# Altium schematic sheet power.SchDoc
size A3; Organization: 合肥弗雷电子; Address1: 玉兰达到14号D栋3楼; Address2: 肥西县桃花镇; Address3: 合肥市; Address4: 安徽省
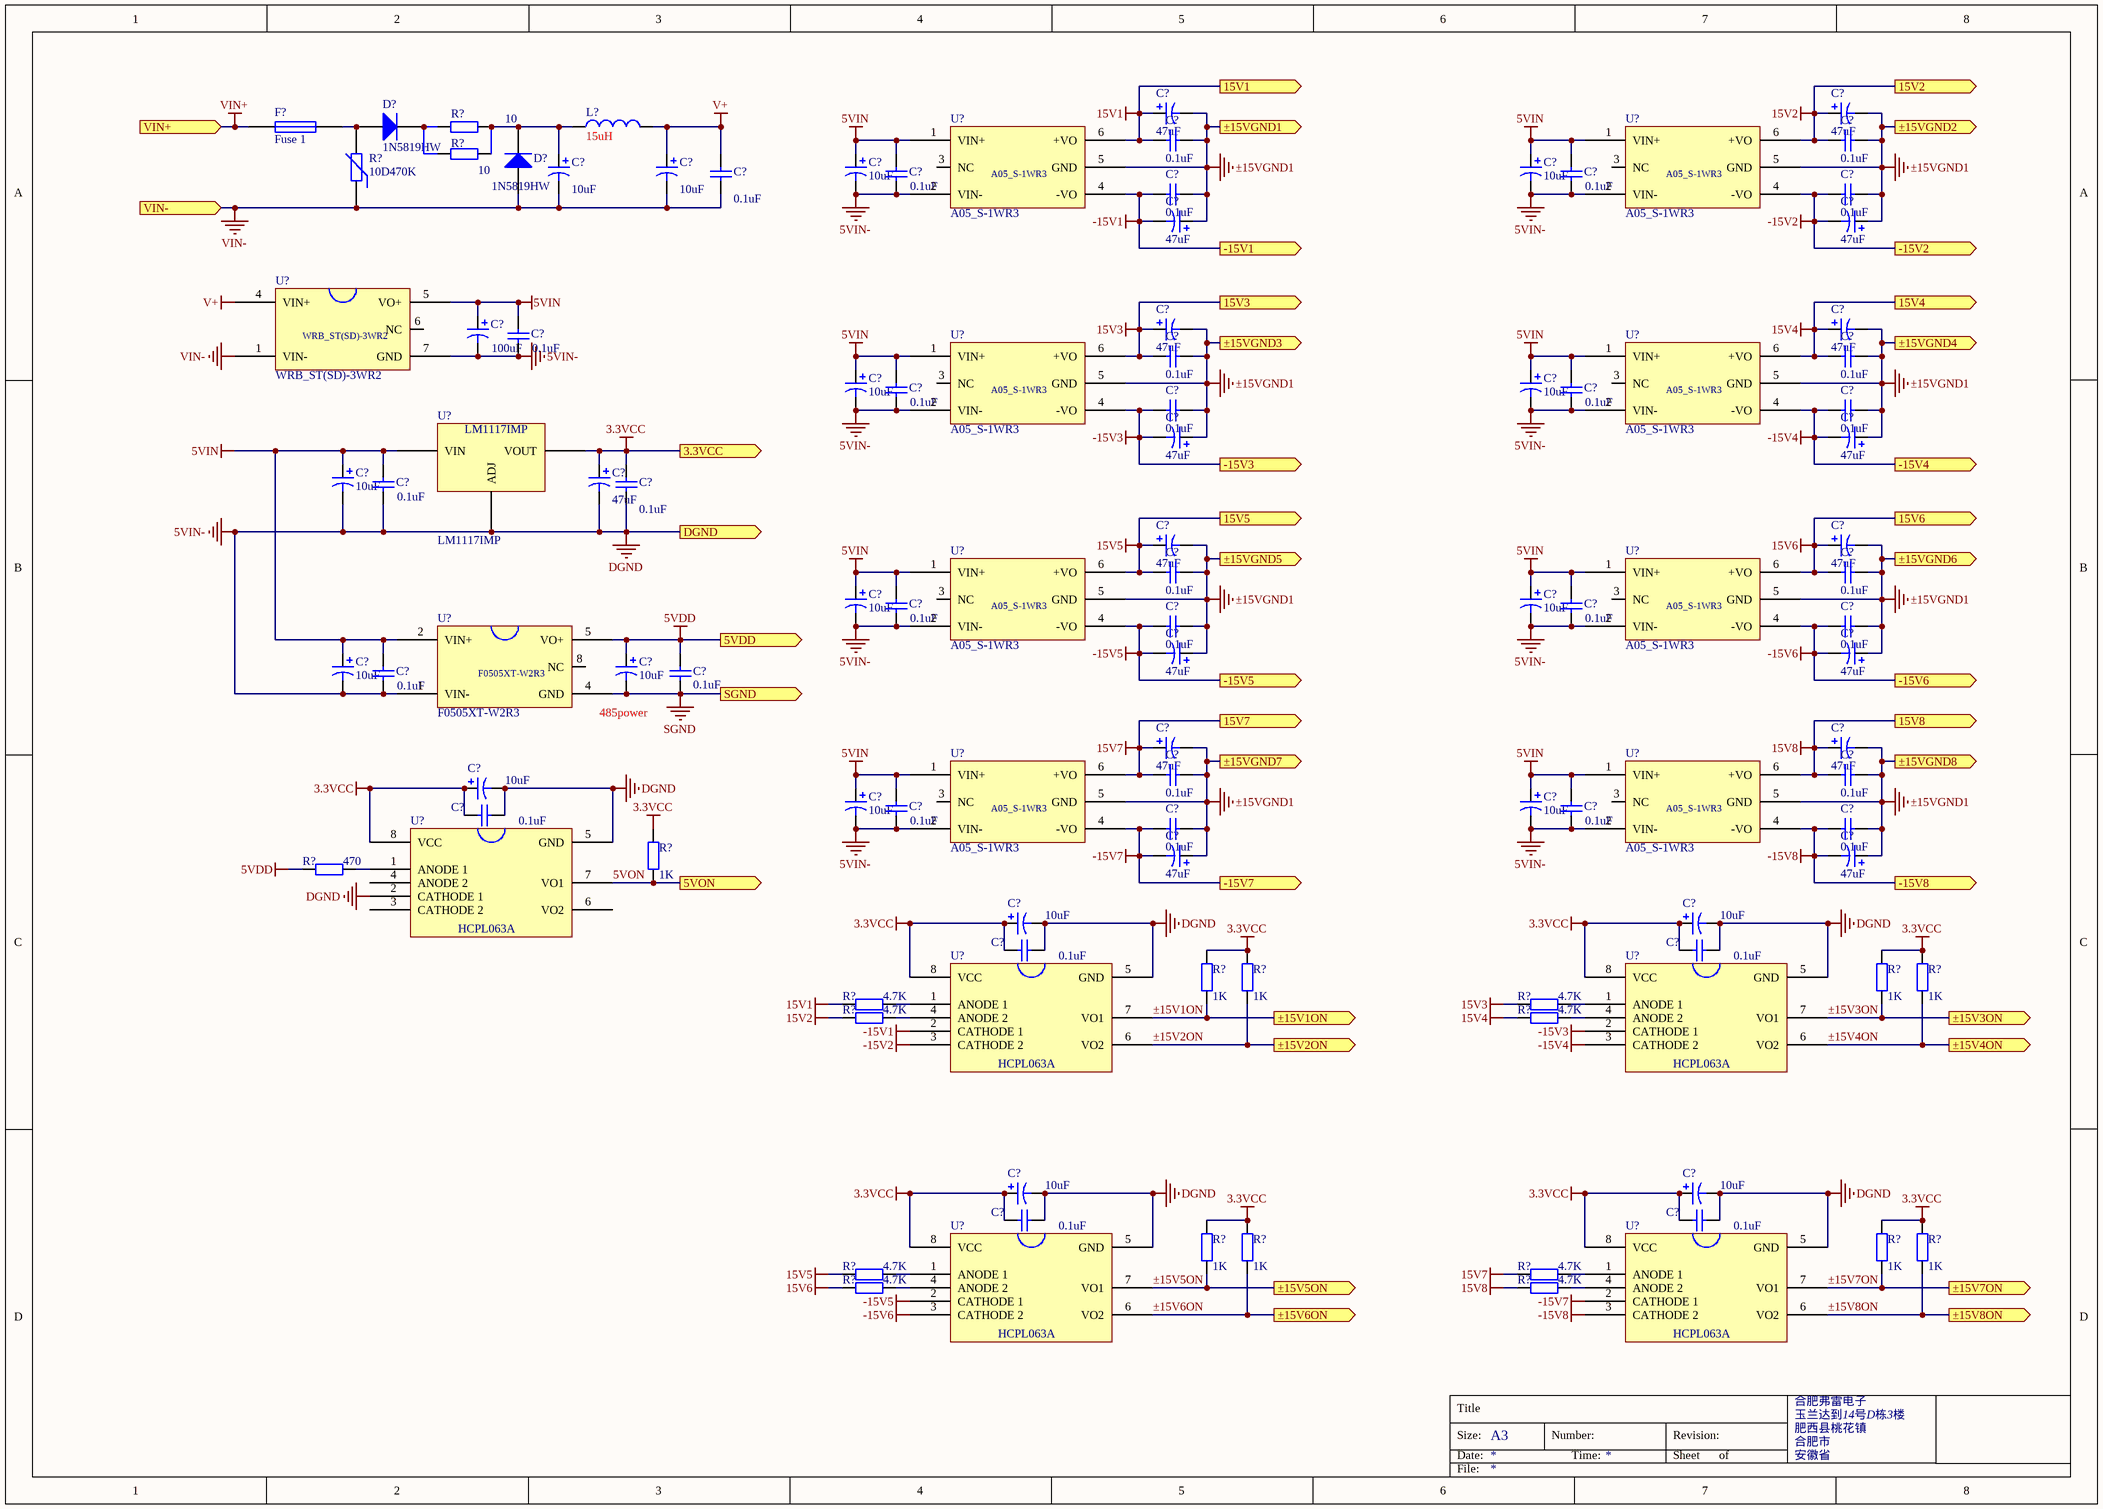
[diagram p0: power.SchDoc]

## Parts
(Parts that share a designator on the sheet are numbered #1, #2 ... from top to bottom, then left to right.)
C?#1  value 47uF  [CB]  (hidden comment: T494B476K025ATAUTO)
C?#2  value 47uF  [CB]  (hidden comment: T494B476K025ATAUTO)
C?#3  value 0.1uF  [0805c]  (hidden comment: CC0805MRX7R9BB104)
C?#4  value 0.1uF  [0805c]  (hidden comment: CC0805MRX7R9BB104)
C?#5  value 10uF  [Φ6.3×11.5]  (hidden comment: ECR1HQG100M-063007)
C?#6  value 10uF  [Φ6.3×11.5]  (hidden comment: ECR1HQG100M-063007)
C?#7  value 0.1uF  [0805c]  (hidden comment: CC0805MRX7R9BB104)
C?#8  value 10uF  [CB]  (hidden comment: T494B106M006AHAUTO)
C?#9  value 10uF  [CB]  (hidden comment: T494B106M006AHAUTO)
C?#10  value 0.1uF  [0805c]  (hidden comment: CC0805MRX7R9BB104)
C?#11  value 0.1uF  [0805c]  (hidden comment: CC0805MRX7R9BB104)
C?#12  value 0.1uF  [0805c]  (hidden comment: CC0805MRX7R9BB104)
C?#13  value 0.1uF  [0805c]  (hidden comment: CC0805MRX7R9BB104)
C?#14  value 47uF  [CB]  (hidden comment: T494B476K025ATAUTO)
C?#15  value 47uF  [CB]  (hidden comment: T494B476K025ATAUTO)
C?#16  value 47uF  [CB]  (hidden comment: T494B476K025ATAUTO)
C?#17  value 47uF  [CB]  (hidden comment: T494B476K025ATAUTO)
C?#18  value 100uF  [CB]  (hidden comment: T494B107M006AHAUTO)
C?#19  value 0.1uF  [0805c]  (hidden comment: CC0805MRX7R9BB104)
C?#20  value 0.1uF  [0805c]  (hidden comment: CC0805MRX7R9BB104)
C?#21  value 0.1uF  [0805c]  (hidden comment: CC0805MRX7R9BB104)
C?#22  value 10uF  [CB]  (hidden comment: T494B106M006AHAUTO)
C?#23  value 10uF  [CB]  (hidden comment: T494B106M006AHAUTO)
C?#24  value 0.1uF  [0805c]  (hidden comment: CC0805MRX7R9BB104)
C?#25  value 0.1uF  [0805c]  (hidden comment: CC0805MRX7R9BB104)
C?#26  value 0.1uF  [0805c]  (hidden comment: CC0805MRX7R9BB104)
C?#27  value 0.1uF  [0805c]  (hidden comment: CC0805MRX7R9BB104)
C?#28  value 47uF  [CB]  (hidden comment: T494B476K025ATAUTO)
C?#29  value 47uF  [CB]  (hidden comment: T494B476K025ATAUTO)
C?#30  value 10uF  [CB]  (hidden comment: T494B106M006AHAUTO)
C?#31  value 47uF  [CB]  (hidden comment: T494B476M010AHAUTO)
C?#32  value 0.1uF  [0805c]  (hidden comment: CC0805MRX7R9BB104)
C?#33  value 0.1uF  [0805c]  (hidden comment: CC0805MRX7R9BB104)
C?#34  value 47uF  [CB]  (hidden comment: T494B476K025ATAUTO)
C?#35  value 47uF  [CB]  (hidden comment: T494B476K025ATAUTO)
C?#36  value 0.1uF  [0805c]  (hidden comment: CC0805MRX7R9BB104)
C?#37  value 0.1uF  [0805c]  (hidden comment: CC0805MRX7R9BB104)
C?#38  value 10uF  [CB]  (hidden comment: T494B106M006AHAUTO)
C?#39  value 10uF  [CB]  (hidden comment: T494B106M006AHAUTO)
C?#40  value 0.1uF  [0805c]  (hidden comment: CC0805MRX7R9BB104)
C?#41  value 0.1uF  [0805c]  (hidden comment: CC0805MRX7R9BB104)
C?#42  value 0.1uF  [0805c]  (hidden comment: CC0805MRX7R9BB104)
C?#43  value 0.1uF  [0805c]  (hidden comment: CC0805MRX7R9BB104)
C?#44  value 10uF  [CB]  (hidden comment: T494B106M006AHAUTO)
C?#45  value 10uF  [CB]  (hidden comment: T494B106M006AHAUTO)
C?#46  value 47uF  [CB]  (hidden comment: T494B476K025ATAUTO)
C?#47  value 47uF  [CB]  (hidden comment: T494B476K025ATAUTO)
C?#48  value 0.1uF  [0805c]  (hidden comment: CC0805MRX7R9BB104)
C?#49  value 0.1uF  [0805c]  (hidden comment: CC0805MRX7R9BB104)
C?#50  value 47uF  [CB]  (hidden comment: T494B476K025ATAUTO)
C?#51  value 47uF  [CB]  (hidden comment: T494B476K025ATAUTO)
C?#52  value 0.1uF  [0805c]  (hidden comment: CC0805MRX7R9BB104)
C?#53  value 0.1uF  [0805c]  (hidden comment: CC0805MRX7R9BB104)
C?#54  value 10uF  [CB]  (hidden comment: T494B106M006AHAUTO)
C?#55  value 0.1uF  [0805c]  (hidden comment: CC0805MRX7R9BB104)
C?#56  value 10uF  [CB]  (hidden comment: T494B106M006AHAUTO)
C?#57  value 10uF  [CB]  (hidden comment: T494B106M006AHAUTO)
C?#58  value 0.1uF  [0805c]  (hidden comment: CC0805MRX7R9BB104)
C?#59  value 0.1uF  [0805c]  (hidden comment: CC0805MRX7R9BB104)
C?#60  value 0.1uF  [0805c]  (hidden comment: CC0805MRX7R9BB104)
C?#61  value 0.1uF  [0805c]  (hidden comment: CC0805MRX7R9BB104)
C?#62  value 47uF  [CB]  (hidden comment: T494B476K025ATAUTO)
C?#63  value 47uF  [CB]  (hidden comment: T494B476K025ATAUTO)
C?#64  value 10uF  [CB]  (hidden comment: T494B106M006AHAUTO)
C?#65  value 10uF  [CB]  (hidden comment: T494B106M006AHAUTO)
C?#66  value 0.1uF  [0805c]  (hidden comment: CC0805MRX7R9BB104)
C?#67  value 0.1uF  [0805c]  (hidden comment: CC0805MRX7R9BB104)
C?#68  value 10uF  [CB]  (hidden comment: T494B106M006AHAUTO)
C?#69  value 10uF  [CB]  (hidden comment: T494B106M006AHAUTO)
C?#70  value 0.1uF  [0805c]  (hidden comment: CC0805MRX7R9BB104)
C?#71  value 0.1uF  [0805c]  (hidden comment: CC0805MRX7R9BB104)
D?#1  1N5819HW  [sod123]
D?#2  1N5819HW  [sod123]
F?  Fuse 1  [0805r]
L?  value 15uH  [vls4012]  (hidden comment: VLS4012HBX-150M)
R?#1  value 10  [0805R]  (hidden comment: PNP-200KJBJ26-10R)
R?#2  value 10  [0805R]  (hidden comment: PNP-200KJBJ26-10R)
R?#3  10D470K  [mov]
R?#4  value 1K  [0805R]  (hidden comment: RC0805JR-071KL)
R?#5  value 470  [0805R]  (hidden comment: RC0805JR-07470RL)
R?#6  value 1K  [0805R]  (hidden comment: RC0805JR-071KL)
R?#7  value 1K  [0805R]  (hidden comment: RC0805JR-071KL)
R?#8  value 1K  [0805R]  (hidden comment: RC0805JR-071KL)
R?#9  value 1K  [0805R]  (hidden comment: RC0805JR-071KL)
R?#10  value 4.7K  [0805R]  (hidden comment: RC0805JR-074700RL)
R?#11  value 4.7K  [0805R]  (hidden comment: RC0805JR-074700RL)
R?#12  value 4.7K  [0805R]  (hidden comment: RC0805JR-074700RL)
R?#13  value 4.7K  [0805R]  (hidden comment: RC0805JR-074700RL)
R?#14  value 1K  [0805R]  (hidden comment: RC0805JR-071KL)
R?#15  value 1K  [0805R]  (hidden comment: RC0805JR-071KL)
R?#16  value 1K  [0805R]  (hidden comment: RC0805JR-071KL)
R?#17  value 1K  [0805R]  (hidden comment: RC0805JR-071KL)
R?#18  value 4.7K  [0805R]  (hidden comment: RC0805JR-074700RL)
R?#19  value 4.7K  [0805R]  (hidden comment: RC0805JR-074700RL)
R?#20  value 4.7K  [0805R]  (hidden comment: RC0805JR-074700RL)
R?#21  value 4.7K  [0805R]  (hidden comment: RC0805JR-074700RL)
U?#1  A05_S-1WR3  [A05_S-1WR3]
U?#2  A05_S-1WR3  [A05_S-1WR3]
U?#3  WRB_ST(SD)-3WR2  [WRB_ST(SD)-3WR2]
U?#4  A05_S-1WR3  [A05_S-1WR3]
U?#5  A05_S-1WR3  [A05_S-1WR3]
U?#6  LM1117IMP  [SOT223_M]
U?#7  A05_S-1WR3  [A05_S-1WR3]
U?#8  A05_S-1WR3  [A05_S-1WR3]
U?#9  F0505XT-W2R3  [F0505XT-W2R3]
U?#10  A05_S-1WR3  [A05_S-1WR3]
U?#11  A05_S-1WR3  [A05_S-1WR3]
U?#12  HCPL063A  [SO-8-N]  (value not drawn)
U?#13  HCPL063A  [SO-8-N]  (value not drawn)
U?#14  HCPL063A  [SO-8-N]  (value not drawn)
U?#15  HCPL063A  [SO-8-N]  (value not drawn)
U?#16  HCPL063A  [SO-8-N]  (value not drawn)

## Ports
3.3VCC (out), 5VDD (out), 5VON (out), 15V1 (out), 15V2 (out), 15V3 (out), 15V4 (out), 15V5 (out), 15V6 (out), 15V7 (out), 15V8 (out), -15V1 (out), -15V2 (out), -15V3 (out), -15V4 (out), -15V5 (out), -15V6 (out), -15V7 (out), -15V8 (out), DGND (out), SGND (out), VIN+ (in), VIN- (in), ±15V1ON (out), ±15V2ON (out), ±15V3ON (out), ±15V4ON (out), ±15V5ON (out), ±15V6ON (out), ±15V7ON (out), ±15V8ON (out), ±15VGND1 (out), ±15VGND2 (out), ±15VGND3 (out), ±15VGND4 (out), ±15VGND5 (out), ±15VGND6 (out), ±15VGND7 (out), ±15VGND8 (out)

## Nets
3.3VCC: C?#31.1 C?#32.1 C?#54.1 C?#55.1 C?#64.1 C?#65.1 C?#66.1 C?#67.1 C?#68.1 C?#69.1 C?#70.1 C?#71.1 R?#4.1 R?#6.1 R?#7.1 R?#8.1 R?#9.1 R?#14.1 R?#15.1 R?#16.1 R?#17.1 U?#6.2(VOUT) U?#12.8(VCC) U?#13.8(VCC) U?#14.8(VCC) U?#15.8(VCC) U?#16.8(VCC) ; port 3.3VCC
5VDD: C?#45.1 C?#49.2 R?#5.2 U?#9.5(VO+) ; port 5VDD
5VIN: C?#8.1 C?#9.1 C?#10.2 C?#12.2 C?#18.1 C?#19.2 C?#22.1 C?#23.1 C?#24.2 C?#26.2 C?#30.1 C?#33.2 C?#38.1 C?#39.1 C?#40.2 C?#42.2 C?#44.1 C?#48.2 C?#56.1 C?#57.1 C?#58.2 C?#60.2 U?#1.1(VIN+) U?#2.1(VIN+) U?#3.5(VO+) U?#4.1(VIN+) U?#5.1(VIN+) U?#6.3(VIN) U?#7.1(VIN+) U?#8.1(VIN+) U?#9.2(VIN+) U?#10.1(VIN+) U?#11.1(VIN+)
5VIN-: C?#8.2 C?#9.2 C?#10.1 C?#12.1 C?#18.2 C?#19.1 C?#22.2 C?#23.2 C?#24.1 C?#26.1 C?#30.2 C?#31.2 C?#32.2 C?#33.1 C?#38.2 C?#39.2 C?#40.1 C?#42.1 C?#44.2 C?#48.1 C?#54.2 C?#55.2 C?#56.2 C?#57.2 C?#58.1 C?#60.1 C?#64.2 C?#65.2 C?#66.2 C?#67.2 C?#68.2 C?#69.2 C?#70.2 C?#71.2 U?#1.2(VIN-) U?#2.2(VIN-) U?#3.7(GND) U?#4.2(VIN-) U?#5.2(VIN-) U?#6.1(ADJ) U?#7.2(VIN-) U?#8.2(VIN-) U?#9.1(VIN-) U?#10.2(VIN-) U?#11.2(VIN-) U?#12.2(CATHODE_1) U?#12.5(GND) U?#13.5(GND) U?#14.5(GND) U?#15.5(GND) U?#16.5(GND) ; port DGND  [also labelled DGND]
15V1: C?#1.1 C?#3.1 R?#10.2 U?#1.6(+VO) ; port 15V1
15V2: C?#2.1 C?#4.1 R?#12.2 U?#2.6(+VO) ; port 15V2
15V3: C?#16.1 C?#20.1 R?#11.2 U?#4.6(+VO) ; port 15V3
15V4: C?#17.1 C?#21.1 R?#13.2 U?#5.6(+VO) ; port 15V4
15V5: C?#34.1 C?#36.1 R?#18.2 U?#7.6(+VO) ; port 15V5
15V6: C?#35.1 C?#37.1 R?#20.2 U?#8.6(+VO) ; port 15V6
15V7: C?#50.1 C?#52.1 R?#19.2 U?#10.6(+VO) ; port 15V7
15V8: C?#51.1 C?#53.1 R?#21.2 U?#11.6(+VO) ; port 15V8
-15V1: C?#11.1 C?#14.2 U?#1.4(-VO) U?#13.2(CATHODE_1) ; port -15V1
-15V2: C?#13.1 C?#15.2 U?#2.4(-VO) U?#13.3(CATHODE_2) ; port -15V2
-15V3: C?#25.1 C?#28.2 U?#4.4(-VO) U?#14.2(CATHODE_1) ; port -15V3
-15V4: C?#27.1 C?#29.2 U?#5.4(-VO) U?#14.3(CATHODE_2) ; port -15V4
-15V5: C?#41.1 C?#46.2 U?#7.4(-VO) U?#15.2(CATHODE_1) ; port -15V5
-15V6: C?#43.1 C?#47.2 U?#8.4(-VO) U?#15.3(CATHODE_2) ; port -15V6
-15V7: C?#59.1 C?#62.2 U?#10.4(-VO) U?#16.2(CATHODE_1) ; port -15V7
-15V8: C?#61.1 C?#63.2 U?#11.4(-VO) U?#16.3(CATHODE_2) ; port -15V8
SGND: C?#45.2 C?#49.1 U?#9.4(GND) ; port SGND
V+: C?#6.1 C?#7.1 L?.2 U?#3.4(VIN+)
VIN+: F?.1 ; port VIN+
VIN-: C?#5.2 C?#6.2 C?#7.2 D?#2.1(A) R?#3.1 U?#3.1(VIN-) ; port VIN-
±15VGND1: C?#1.2 C?#2.2 C?#3.2 C?#4.2 C?#11.2 C?#13.2 C?#14.1 C?#15.1 C?#16.2 C?#17.2 C?#20.2 C?#21.2 C?#25.2 C?#27.2 C?#28.1 C?#29.1 C?#34.2 C?#35.2 C?#36.2 C?#37.2 C?#41.2 C?#43.2 C?#46.1 C?#47.1 C?#50.2 C?#51.2 C?#52.2 C?#53.2 C?#59.2 C?#61.2 C?#62.1 C?#63.1 U?#1.5(GND) U?#2.5(GND) U?#4.5(GND) U?#5.5(GND) U?#7.5(GND) U?#8.5(GND) U?#10.5(GND) U?#11.5(GND) ; port ±15VGND1, port ±15VGND2, port ±15VGND3, port ±15VGND4, port ±15VGND5, port ±15VGND6, port ±15VGND7, port ±15VGND8
5VON: R?#4.2 U?#12.7(VO1) ; port 5VON
±15V1ON: R?#6.2 U?#13.7(VO1) ; port ±15V1ON
±15V2ON: R?#7.2 U?#13.6(VO2) ; port ±15V2ON
±15V3ON: R?#8.2 U?#14.7(VO1) ; port ±15V3ON
±15V4ON: R?#9.2 U?#14.6(VO2) ; port ±15V4ON
±15V5ON: R?#14.2 U?#15.7(VO1) ; port ±15V5ON
±15V6ON: R?#15.2 U?#15.6(VO2) ; port ±15V6ON
±15V7ON: R?#16.2 U?#16.7(VO1) ; port ±15V7ON
±15V8ON: R?#17.2 U?#16.6(VO2) ; port ±15V8ON
NetC?#5_1: C?#5.1 D?#2.2(K) L?.1 R?#1.1 R?#2.1
NetD?#1_1: D?#1.1(A) F?.2 R?#3.2
NetD?#1_2: D?#1.2(K) R?#1.2 R?#2.2
NetR?#5_1: R?#5.1 U?#12.1(ANODE_1)
NetR?#10_1: R?#10.1 U?#13.1(ANODE_1)
NetR?#11_1: R?#11.1 U?#14.1(ANODE_1)
NetR?#12_1: R?#12.1 U?#13.4(ANODE_2)
NetR?#13_1: R?#13.1 U?#14.4(ANODE_2)
NetR?#18_1: R?#18.1 U?#15.1(ANODE_1)
NetR?#19_1: R?#19.1 U?#16.1(ANODE_1)
NetR?#20_1: R?#20.1 U?#15.4(ANODE_2)
NetR?#21_1: R?#21.1 U?#16.4(ANODE_2)

Not connected (* = marked no-connect by the designer): U?#1 3(NC); U?#2 3(NC); U?#3 6(NC); U?#4 3(NC); U?#5 3(NC); U?#7 3(NC); U?#8 3(NC); U?#9 8(NC); U?#10 3(NC); U?#11 3(NC); U?#12 3(CATHODE_2) 4(ANODE_2) 6(VO2)

## Notes on the sheet
- 485power
- Title
- Size:
- Date:
- A3
- Number:
- Time:
- Revision:
- Sheet
- of
- File:

## Library data of the parts
C?#1 C?#2 C?#5 C?#6 C?#8 C?#9 C?#14-C?#18 C?#22 C?#23 C?#28-C?#31 C?#34 C?#35 C?#38 C?#39 C?#44-C?#47 C?#50 C?#51 C?#54 C?#56 C?#57 C?#62-C?#65 C?#68 C?#69 = Cap Pol1: Polarized Capacitor (Radial); Published: 8-Jun-2000; LatestRevisionDate: 17-Jul-2002; LatestRevisionNote: Re-released for DXP Platform.; PackageReference: RB7.6-15; Publisher: Altium Limited; PackageDescription: Polarized Capacitor (Radial); 2 Leads
C?#3 C?#4 C?#7 C?#10-C?#13 C?#19-C?#21 C?#24-C?#27 C?#32 C?#33 C?#36 C?#37 C?#40-C?#43 C?#48 C?#49 C?#52 C?#53 C?#55 C?#58-C?#61 C?#66 C?#67 C?#70 C?#71 = Cap: Capacitor; Published: 8-Jun-2000; LatestRevisionDate: 17-Jul-2002; LatestRevisionNote: Re-released for DXP Platform.; PackageReference: RAD-0.3; Publisher: Altium Limited; PackageDescription: Radial Cap, Thru-Hole; 2 Leads; 0.3 in Pin Spacing
D?#1 D?#2 = Diode: Default Diode; Published: 8-Jun-2000; LatestRevisionDate: 17-Jul-2002; LatestRevisionNote: Re-released for DXP Platform.; PackageVersion: Sep-1996; PackageReference: SMC; Publisher: Altium Limited; PackageDescription: DO-214-AB/SMC; 2 C-Bend Leads; Body 7.9 x 5.9 mm, inc. leads (LxW); Code_JEDEC: DO-214-AB
F? = Fuse 1: Fuse; Published: 8-Jun-2000; LatestRevisionDate: 17-Jul-2002; LatestRevisionNote: Re-released for DXP Platform.; PackageReference: PIN-W2/E2.8; Publisher: Altium Limited; PackageDescription: Thru-Hole; 2 Leads
L? = Inductor
R?#1 R?#2 R?#4-R?#21 = Res2: Resistor; Published: 8-Jun-2000; LatestRevisionDate: 17-Jul-2002; LatestRevisionNote: Re-released for DXP Platform.; PackageReference: AXIAL-0.4; Publisher: Altium Limited; PackageDescription: Axial Device, Thru-Hole; 2 Leads; 0.4 in Pin Spacing
R?#3 = Res Varistor: Varistor (Voltage-Sensitive Resistor); Published: 24-Mar-1999; LatestRevisionDate: 29-May-2009; LatestRevisionNote: IPC-7351 Footprint Added.; PackageVersion: Mar-2003; PackageReference: 6-0805; Publisher: Altium Limited; PackageDescription: Chip Resistor 0805 Case Size; Code_IPC: RESC2012